# EAGLE schematic architecture (EAGLE 7.7.0)
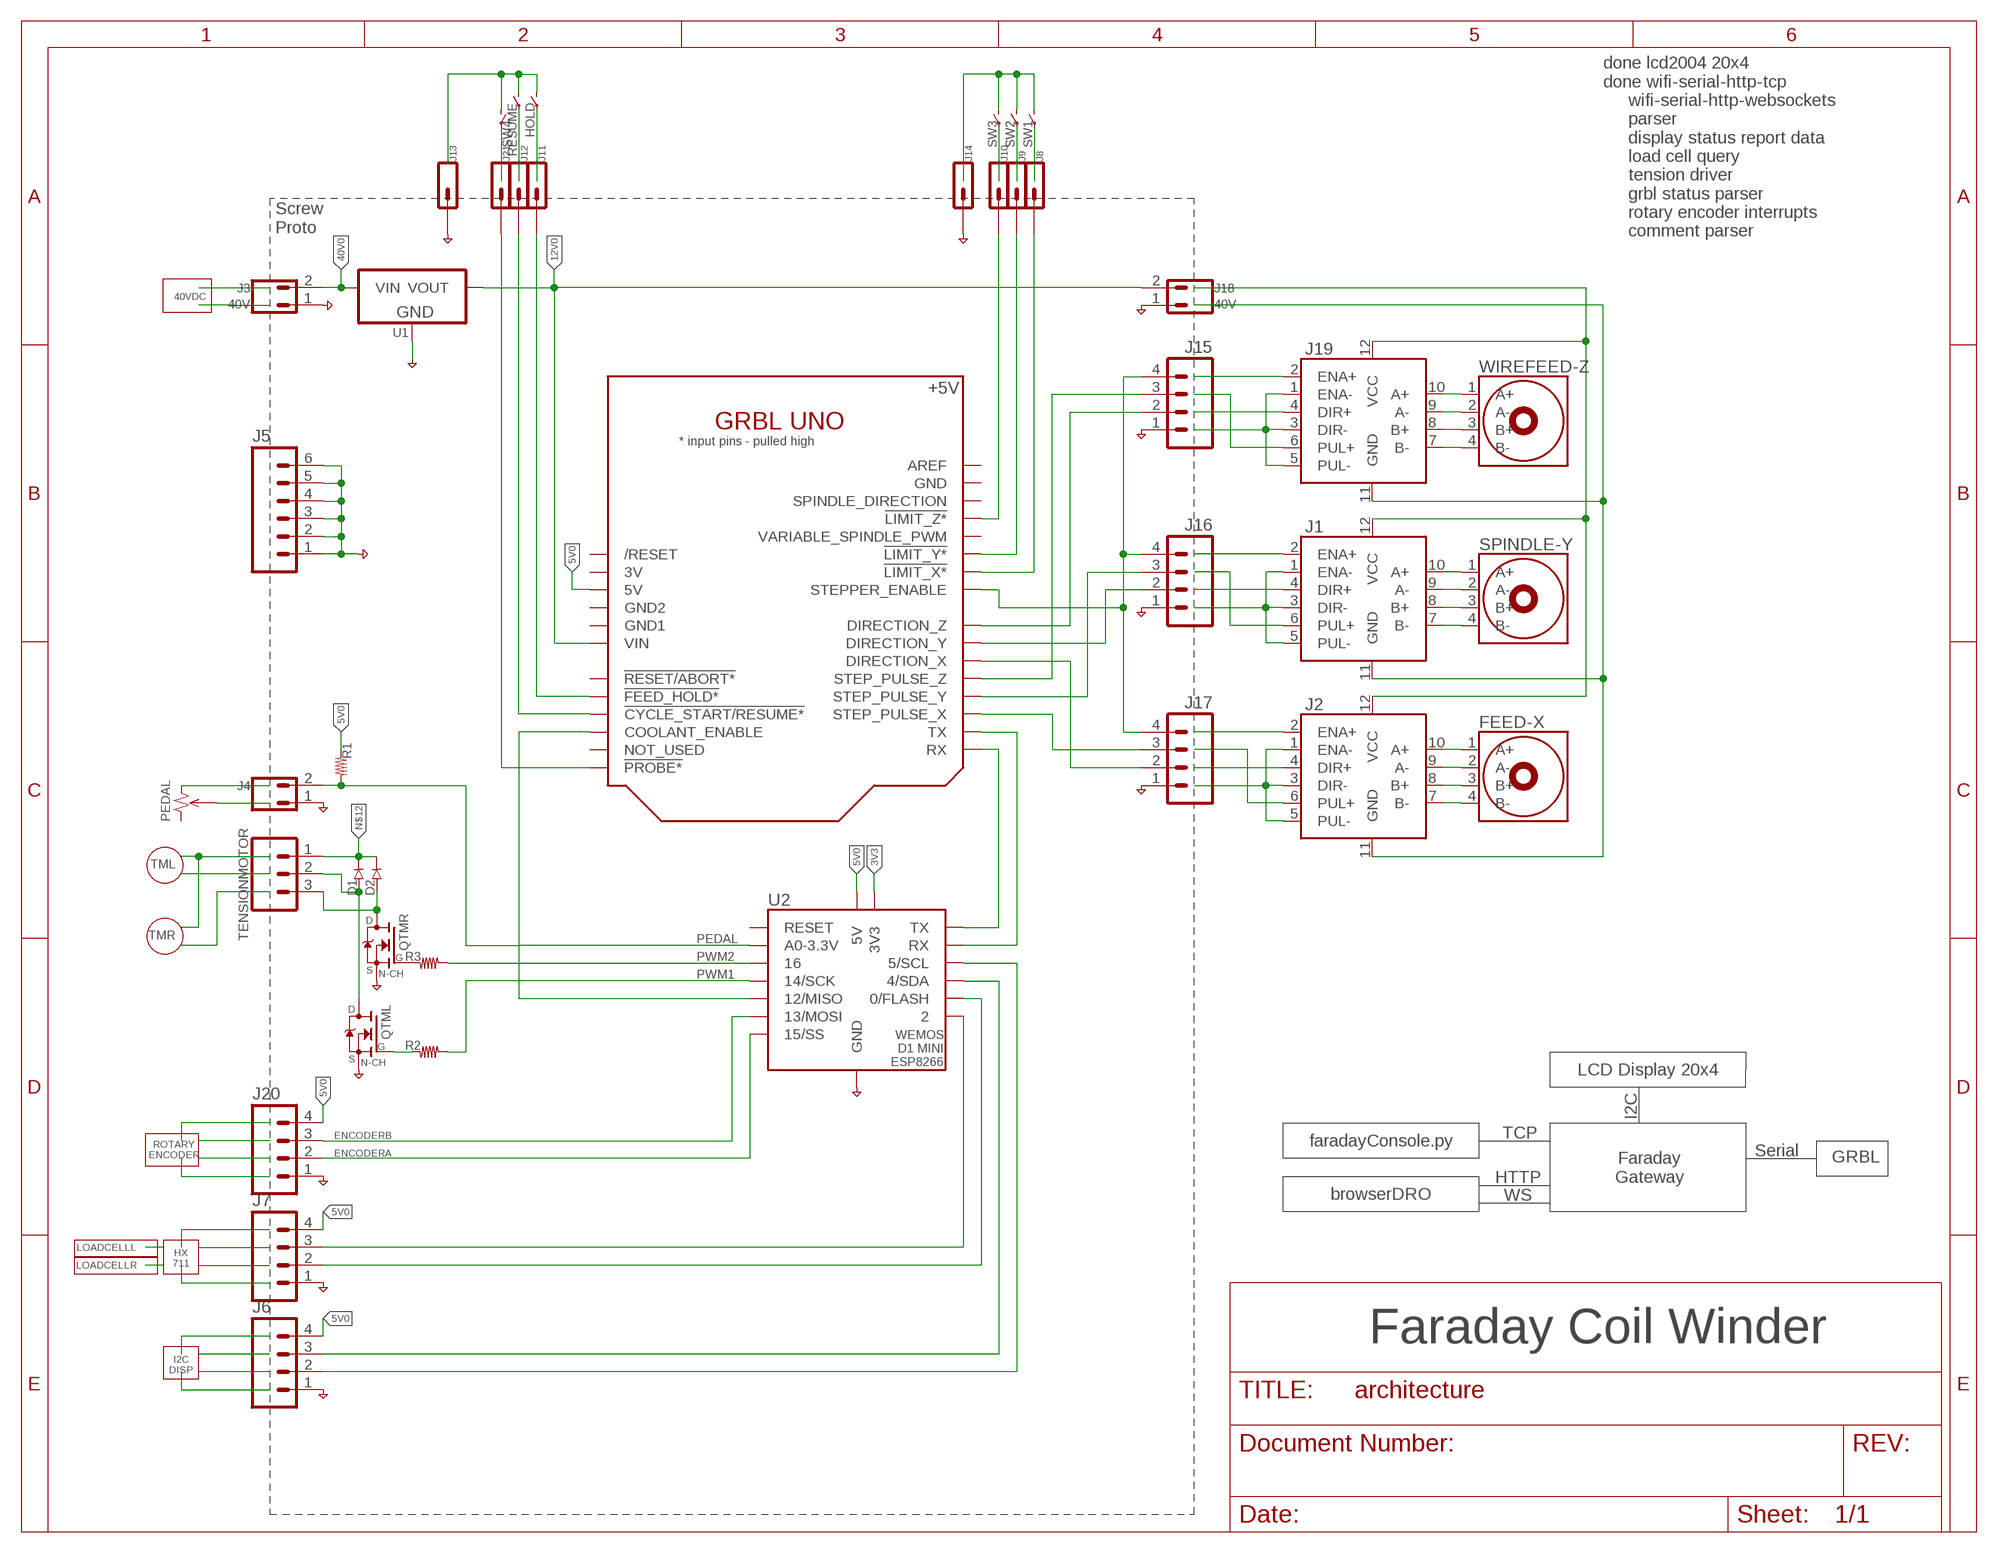
[diagram p0: schematic, sheet 1]

## Parts
D1  DIODE-1N4148  [DO-35]
D2  DIODE-1N4148  [DO-35]
FEED-X  MOTOR-STEPPER-BIPOLAR  [CONN-.100-4]
HOLD  SWITCH-PANEL-SPST  [CONN-.100-2]
J1  MOTOR-STEPPER-DRIVER-SINGLE  [MLSS100-12]
J2  MOTOR-STEPPER-DRIVER-SINGLE  [MLSS100-12]
J3  40V  CONN-02-3.81MM-PLUGIN-SCREW  [CONN-3.81MM-KF2EDG-2]
J4  CONN-02-.100-VERT-HEADER  [CONN-.100-2]
J5  CONN-06-.100-VERT-HEADER  [CONN-.100-6]
J6  CONN-04-.100-VERT-HEADER  [CONN-.100-4]
J7  CONN-04-.100-VERT-HEADER  [CONN-.100-4]
J8  CONN-01  [1X01]
J9  CONN-01  [1X01]
J10  CONN-01  [1X01]
J11  CONN-01  [1X01]
J12  CONN-01  [1X01]
J13  CONN-01  [1X01]
J14  CONN-01  [1X01]
J15  CONN-04-.100-VERT-HEADER  [CONN-.100-4]
J16  CONN-04-.100-VERT-HEADER  [CONN-.100-4]
J17  CONN-04-.100-VERT-HEADER  [CONN-.100-4]
J18  40V  CONN-02-3.81MM-PLUGIN-SCREW  [CONN-3.81MM-KF2EDG-2]
J19  MOTOR-STEPPER-DRIVER-SINGLE  [MLSS100-12]
J20  CONN-04-.100-VERT-HEADER  [CONN-.100-4]
J21  CONN-01  [1X01]
PEDAL  POTENTIOMETER  [CONN-.100-3]
QTML  FET-NCH-TO252  [TO252]
QTMR  FET-NCH-TO252  [TO252]
R1  R-0805  [R0805]
R2  R-0805  [R0805]
R3  R-0805  [R0805]
RESUME  SWITCH-PANEL-SPST  [CONN-.100-2]
SPINDLE-Y  MOTOR-STEPPER-BIPOLAR  [CONN-.100-4]
SW1  SWITCH-PANEL-SPST  [CONN-.100-2]
SW2  SWITCH-PANEL-SPST  [CONN-.100-2]
SW3  SWITCH-PANEL-SPST  [CONN-.100-2]
SW4  SWITCH-PANEL-SPST  [CONN-.100-2]
TENSIONMOTOR  CONN-03-.100  [1X03]
U1  VREG-D2PAK  [D2PAK]
U2  RADIO-WEMOS-D1-MINI-ARDUINO  [WEMOS-D1-MINI]
U$1  BOARD-GRBL-UNOA  [ARDUINO]
WIREFEED-Z  MOTOR-STEPPER-BIPOLAR  [CONN-.100-4]

## Nets
3V3: U2.3V3
5V0: J6.4 J7.4 J20.4 R1.1 U2.5V U$1.5V
12V0: J18.2 U1.3(VOUT) U$1.VIN
40V0: D1.C D2.C J3.2 TENSIONMOTOR.1 U1.1(VIN)
ENCODERA: J20.2 U2.D8(15/SS)
ENCODERB: J20.3 U2.D7(13/MOSI)
GND: J3.1 J4.1 J5.1 J5.2 J5.3 J5.4 J5.5 J5.6 J6.1 J7.1 J13.1 J14.1 J15.1 J16.1 J17.1 J18.1 J20.1 QTML.2(S) QTMR.2(S) U1.2(GND) U2.GND
N$1: J1.10(A+) SPINDLE-Y.1(A+)
N$2: J1.9(A-) SPINDLE-Y.2(A-)
N$3: J1.8(B+) SPINDLE-Y.3(B+)
N$4: J1.7(B-) SPINDLE-Y.4(B-)
N$5: FEED-X.1(A+) J2.10(A+)
N$6: FEED-X.2(A-) J2.9(A-)
N$7: FEED-X.3(B+) J2.8(B+)
N$8: FEED-X.4(B-) J2.7(B-)
N$9: U2.D6(12/MISO) U$1.A3(COOLANT_ENABLE)
N$10: J1.6(PUL+)
N$11: J17.2 U$1.D5(DIRECTION_X)
N$13: J2.2(ENA+)
N$14: U2.TX U$1.D0(RX)
N$15: U2.RX U$1.D1(TX)
N$16: RESUME.1
N$17: HOLD.1
N$18: J6.2 U2.D1(5/SCL)
N$19: J6.3 U2.D2(4/SDA)
N$20: PEDAL.3
N$21: PEDAL.2(W)
N$22: J7.2 U2.D3(0/FLASH)
N$23: J7.3 U2.D4
N$26: D1.A QTML.3(D) TENSIONMOTOR.2
N$27: D2.A QTMR.3(D) TENSIONMOTOR.3
N$28: QTMR.1(G) R3.1
N$29: QTML.1(G) R2.1
N$33: J10.1 U$1.D12(!LIMIT_Z*)
N$34: J9.1 U$1.D10(!LIMIT_Y*)
N$35: SW3.1
N$36: SW2.1
N$37: SW1.1
N$38: SW1.2 SW2.2 SW3.2
N$39: J8.1 U$1.D9(!LIMIT_X*)
N$48: J11.1 U$1.A1(!FEED_HOLD*)
N$49: J12.1 U$1.A2(!CYCLE_START/RESUME*)
N$50: HOLD.2 RESUME.2 SW4.2
N$51: J15.2 U$1.D7(DIRECTION_Z)
N$52: J15.3 U$1.D4(STEP_PULSE_Z)
N$53: J2.4(DIR+)
N$54: J16.2 U$1.D6(DIRECTION_Y)
N$55: J16.3 U$1.D3(STEP_PULSE_Y)
N$56: J17.3 U$1.D2(STEP_PULSE_X)
N$57: J2.6(PUL+)
N$58: J1.2(ENA+)
N$59: J1.4(DIR+)
N$60: J19.10(A+) WIREFEED-Z.1(A+)
N$61: J19.9(A-) WIREFEED-Z.2(A-)
N$62: J19.8(B+) WIREFEED-Z.3(B+)
N$63: J19.7(B-) WIREFEED-Z.4(B-)
N$64: J19.2(ENA+)
N$65: J19.4(DIR+)
N$66: J19.6(PUL+)
N$67: J19.1(ENA-) J19.3(DIR-) J19.5(PUL-)
N$68: J1.1(ENA-) J1.3(DIR-) J1.5(PUL-)
N$69: J2.1(ENA-) J2.3(DIR-) J2.5(PUL-)
N$70: J1.12(VCC) J2.12(VCC) J19.12(VCC)
N$71: J1.11(GND) J19.11(GND)
N$74: J2.11(GND)
N$79: J21.1 U$1.A5(!PROBE*)
N$80: SW4.1
N$83: J15.4 J16.4 J17.4 U$1.D8(STEPPER_ENABLE)
PEDAL: J4.2 R1.2 U2.A0(A0-3.3V)
PWM1: R2.2 U2.D5(14/SCK)
PWM2: R3.2 U2.D0
Unconnected: PEDAL.1 U2.RESET U$1.A0(!RESET/ABORT*) U$1.A4(NOT_USED) U$1.AREF U$1.D11(VARIABLE_SPINDLE_PWM) U$1.D13(SPINDLE_DIRECTION) U$1.RESET(/RESET)

## Notes on the sheet
- done lcd2004 20x4
  done wifi-serial-http-tcp
       wifi-serial-http-websockets
       parser
       display status report data
       load cell query
       tension driver
       grbl status parser
       rotary encoder interrupts
       comment parser
- Screw
  Proto
- 40VDC
- +5V
- TML
- TMR
- LCD Display 20x4
- I2C
- faradayConsole.py | TCP
- ROTARY
  ENCODER
- Serial | GRBL
- Faraday
  Gateway
- HTTP
- browserDRO
- WS
- LOADCELLL
- HX
  711
- LOADCELLR
- Faraday Coil Winder
- I2C
  DISP

## Power pins joined to a net without a drawn wire
3V: U$1.3V
GND: U$1.GND
GND1: U$1.GND1
GND2: U$1.GND2

## Library data of the parts
D1 D2 = holla:DIODE
FEED-X SPINDLE-Y WIREFEED-Z = holla:MOTOR-STEPPER-BIPOLAR
HOLD RESUME SW1-SW4 = holla:SWITCH-PANEL-SPST
J1 J2 J19 = holla:MOTOR-STEPPER-DRIVER-SINGLE
J3 J4 J18 = holla:CONN-02: CONN HEADER 2POS
J5 = holla:CONN-06
J6 J7 J15-J17 J20 = holla:CONN-04
J8-J14 J21 = holla:CONN-01
PEDAL = holla:POTENTIOMETER
QTML QTMR = holla:FET-NCH
R1-R3 = holla:R; DESC: 5%
TENSIONMOTOR = holla:CONN-03
U1 = holla:VREG: Various 3 pin voltage regulators in different packages Double check the right pinout for the right part
U2 = holla:RADIO-WEMOS-D1-MINI-ARDUINO
U$1 = holla:BOARD-GRBL-UNO: Arduino Diecimila/Duemilanove Make a shield with ease, this package has all the named pins as well as the two mounting drill holes and an outline of the USB and DC power connector. The outline is on the DIMENSION layer, so if your board house uses it they will cut the outline to match. http://www.ladyada.net/library/pcb/eaglelibrary.html